# Altium project Peleng.PrjPcb
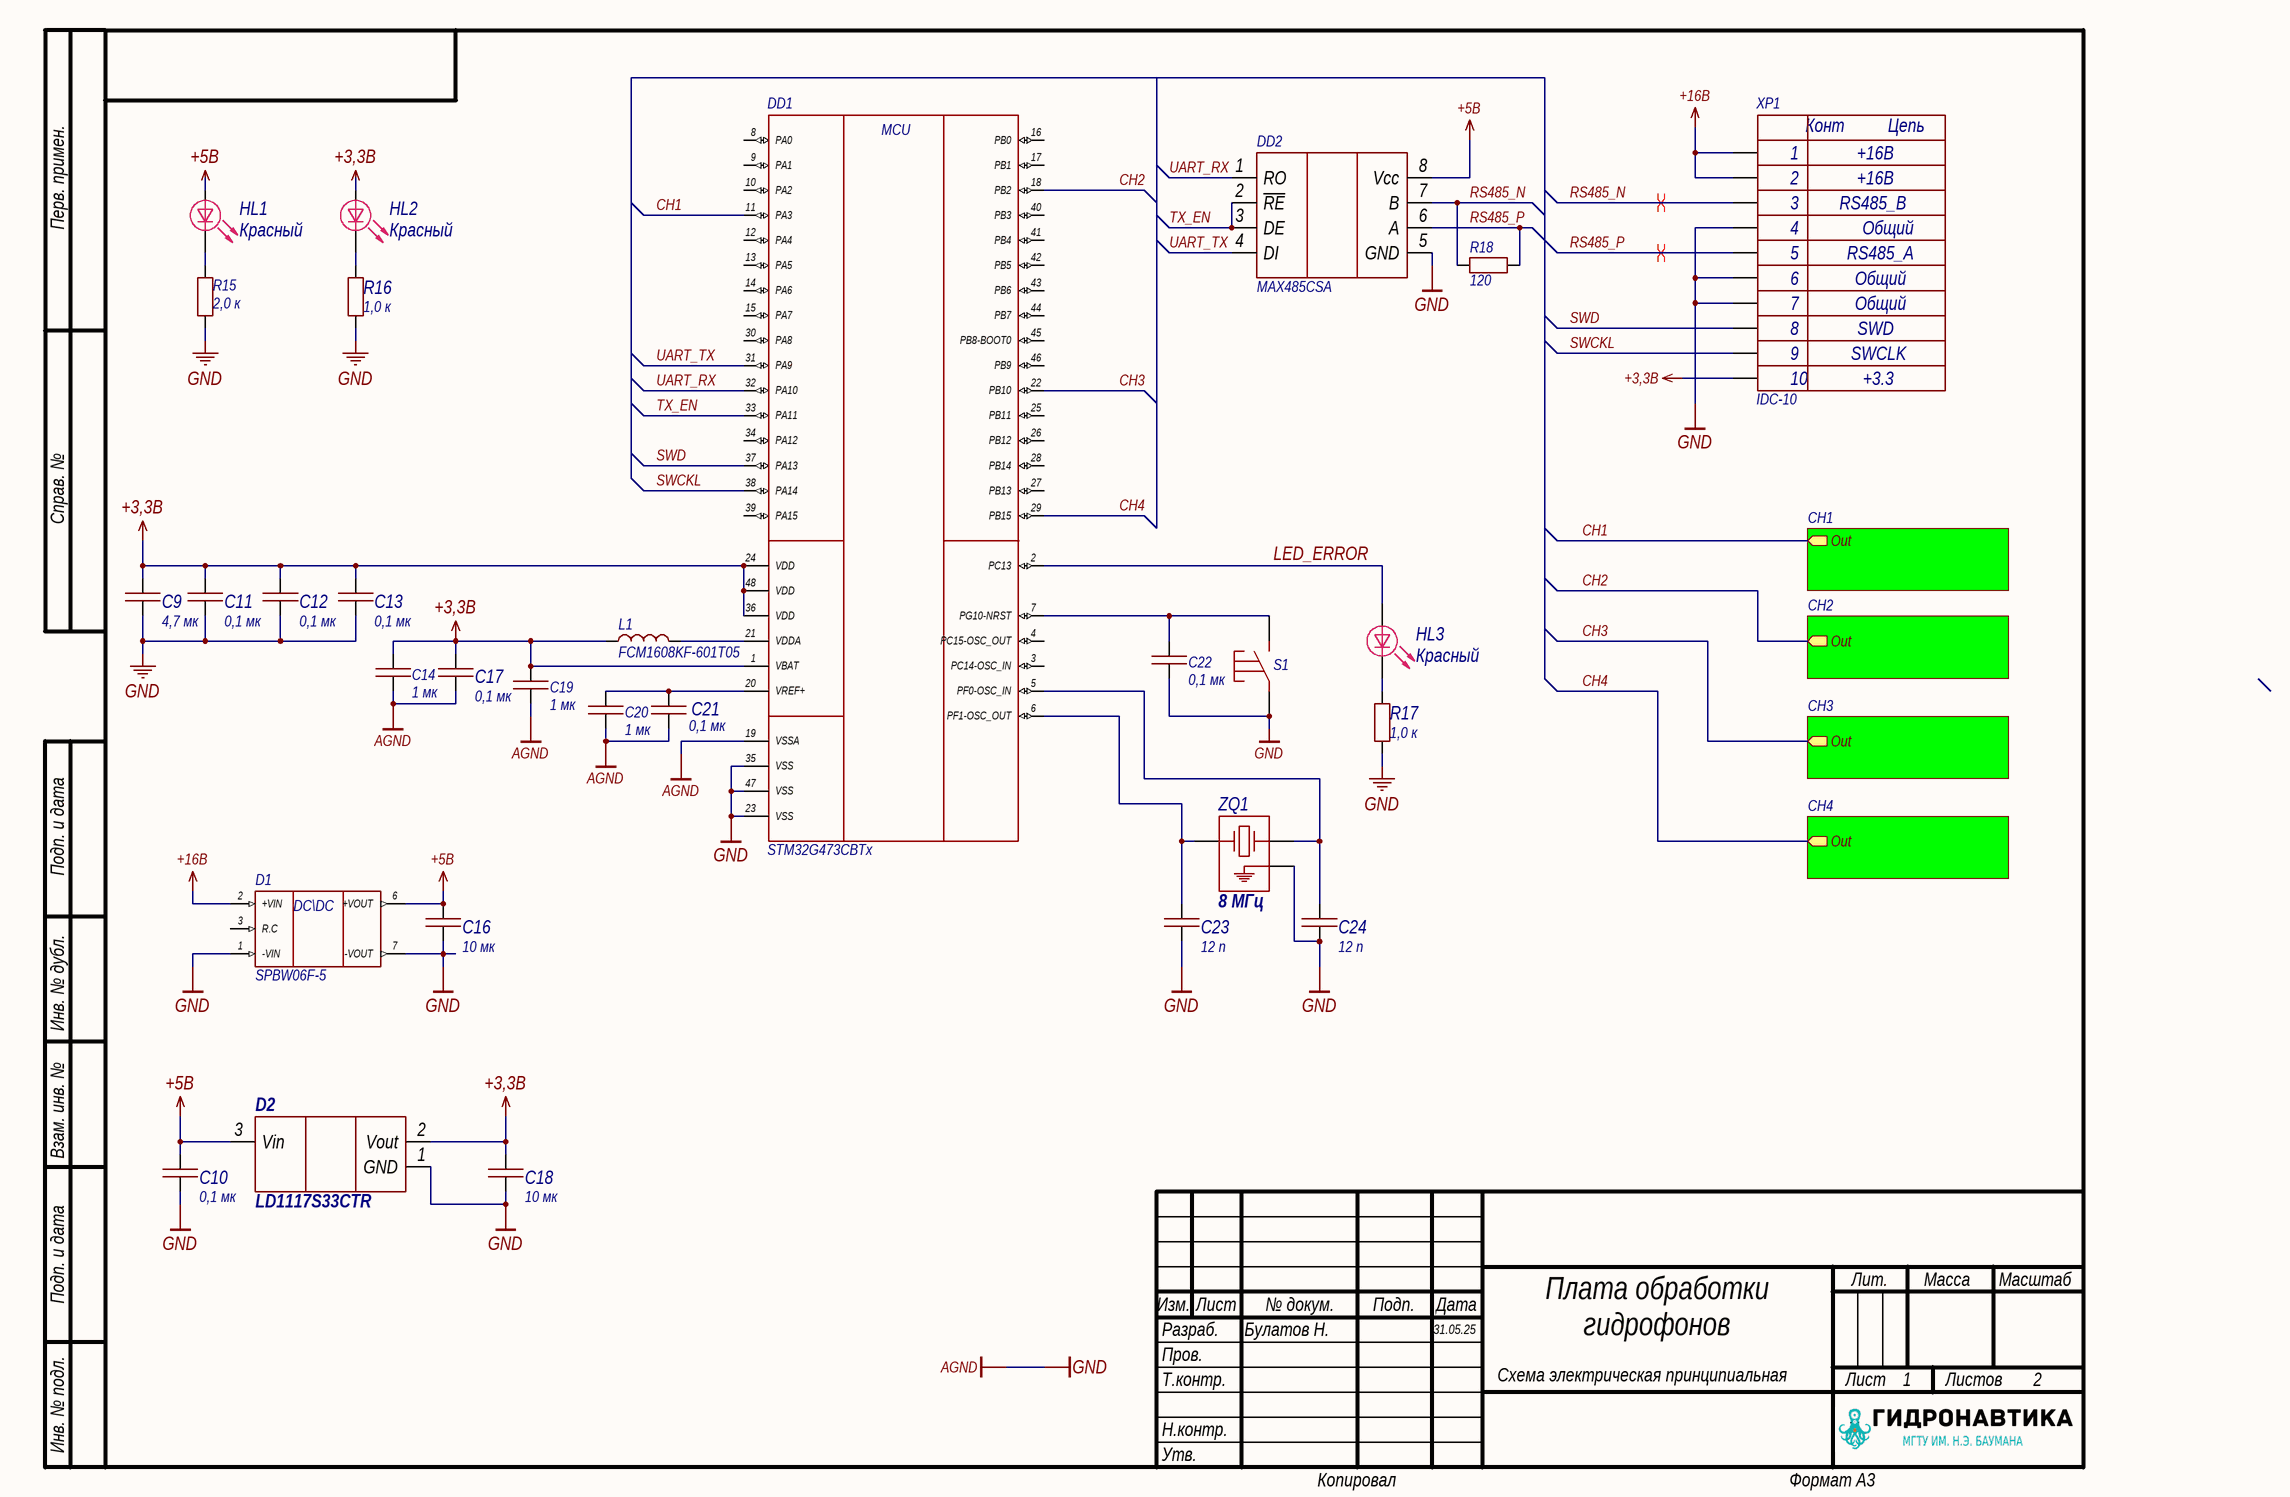
[diagram p0: Main.SchDoc]
Version: 01; Title2: 15В в 300В; Title1: Преобразователь из; Title: Плата обработки гидрофонов; Release_Date: 31.05.25; DrawnBy: Булатов Н.; Decimal_Number_Shematic: ГИДР.123456.001; Decimal_Number_PCB: ГИДР.123456.002
2 sheets, 190 parts. Net scope: hierarchical (ports join the sheet entries above them; power ports are global).
Board file: PCB1.PcbDoc
Sheets:
  Main.SchDoc
    CH1 = Chanel.SchDoc
    CH2 = Chanel.SchDoc
    CH3 = Chanel.SchDoc
    CH4 = Chanel.SchDoc

## Sheet Main.SchDoc: Плата обработки гидрофонов
size 420 x 297 mm; Address1: Address1; Address2: Address2; Address3: Address3; Address4: Address4; SheetNumber: 1; SheetTotal: 2

### Parts
C9  value 4,7 мк  [1206C]  (hidden comment: Capacitor)
C10  value 0,1 мк  [0603C]  (hidden comment: Capacitor)
C11  value 0,1 мк  [0603C]  (hidden comment: Capacitor)
C12  value 0,1 мк  [0603C]  (hidden comment: Capacitor)
C13  value 0,1 мк  [0603C]  (hidden comment: Capacitor)
C14  value 1 мк  [0603C]  (hidden comment: Capacitor)
C16  value 10 мк  [1210C]  (hidden comment: Capacitor)
C17  value 0,1 мк  [0603C]  (hidden comment: Capacitor)
C18  value 10 мк  [1210C]  (hidden comment: Capacitor)
C19  value 1 мк  [0603C]  (hidden comment: Capacitor)
C20  value 1 мк  [0603C]  (hidden comment: Capacitor)
C21  value 0,1 мк  [0603C]  (hidden comment: Capacitor)
C22  value 0,1 мк  [0603C]  (hidden comment: Capacitor)
C23  value 12 п  [0603C]  (hidden comment: Capacitor)
C24  value 12 п  [0603C]  (hidden comment: Capacitor)
D1  SPBW06F-5  [CONV_SPBW06F-12]
D2  LD1117S33CTR  [SOT223]
DD1  STM32G473CBTx  [LQFP48-7x7mm]
DD2  MAX485CSA  [SOIC-8]
HL1  Color: Красный  [0805D]  (hidden comment: LED)
HL2  Color: Красный  [0805D]  (hidden comment: LED)
HL3  Color: Красный  [0805D]  (hidden comment: LED)
L1  FCM1608KF-601T05  [0603L]
R15  value 2,0 к  [0603R]  (hidden comment: Resistor)
R16  value 1,0 к  [0603R]  (hidden comment: Resistor)
R17  value 1,0 к  [0603R]  (hidden comment: Resistor)
R18  value 120  [0603R]  (hidden comment: Resistor)
S1  TSS-TD-19XA-XTR  [TSS-TD-19XA-XTR]  (value not drawn)
XP1  IDC-10  Value1: +16В  Value3: Общий  Value5: RS485_A  Value6: RS485_B  Value8: SWD  Value9: SWCLK  Value10: +3.3  [IDC-10]
ZQ1  value 8 МГц  [QSMD3.2x2.5]  (hidden comment: XTAL_GND)

### Sub-sheets
CH1 = Chanel.SchDoc: Out (out)
CH2 = Chanel.SchDoc: Out (out)
CH3 = Chanel.SchDoc: Out (out)
CH4 = Chanel.SchDoc: Out (out)

### Nets
+3,3В: C9.2 C11.2 C12.2 C13.2 C14.2 C17.2 C18.2 C19.2 D2.2(Vout) DD1.1(VBAT) DD1.24(VDD) DD1.36(VDD) DD1.48(VDD) HL2.1 L1.1 XP1.10
+5В: C10.2 C16.2 D1.6(+VOUT) D2.3(Vin) DD2.8(Vcc) HL1.1
+16В: D1.2(+VIN) XP1.1 XP1.2
AGND: C9.1 C10.1 C11.1 C12.1 C13.1 C14.1 C16.1 C17.1 C18.1 C19.1 C20.1 C21.1 C22.1 C23.1 C24.1 D1.1(-VIN) D1.7(-VOUT) D2.1(GND) DD1.19(VSSA) DD1.23(VSS) DD1.35(VSS) DD1.47(VSS) DD2.5(GND) R15.1 R16.1 R17.1 S1.1 XP1.4 XP1.6 XP1.7 ZQ1.3  [also labelled GND]
CH1: DD1.11(PA3) ; sheet CH1/Out
CH2: DD1.18(PB2) ; sheet CH2/Out
CH3: DD1.22(PB10) ; sheet CH3/Out
CH4: DD1.29(PB15) ; sheet CH4/Out
LED_ERROR: DD1.2(PC13) HL3.1
RS485_N: DD2.7(B) R18.2 XP1.3
RS485_P: DD2.6(A) R18.1 XP1.5
SWCKL: DD1.38(PA14) XP1.9
SWD: DD1.37(PA13) XP1.8
TX_EN: DD1.33(PA11) DD2.2(~{RE}) DD2.3(DE)
UART_RX: DD1.32(PA10) DD2.1(RO)
UART_TX: DD1.31(PA9) DD2.4(DI)
NetC20_2: C20.2 C21.2 DD1.20(VREF+)
NetC22_2: C22.2 DD1.7(PG10-NRST) S1.2
NetC23_2: C23.2 DD1.6(PF1-OSC_OUT) ZQ1.1
NetC24_2: C24.2 DD1.5(PF0-OSC_IN) ZQ1.2
NetDD1_21: DD1.21(VDDA) L1.2
NetHL1_2: HL1.2 R15.2
NetHL2_2: HL2.2 R16.2
NetHL3_2: HL3.2 R17.2

Not connected (* = marked no-connect by the designer): D1 3(R.C); DD1 3(PC14-OSC_IN) 4(PC15-OSC_OUT) 8(PA0) 9(PA1) 10(PA2) 12(PA4) 13(PA5) 14(PA6) 15(PA7) 16(PB0) 17(PB1) 25(PB11) 26(PB12) 27(PB13) 28(PB14) 30(PA8) 34(PA12) 39(PA15) 40(PB3) 41(PB4) 42(PB5) 43(PB6) 44(PB7) 45(PB8-BOOT0) 46(PB9)

### Layout directives
differential pair: RS485_N, RS485_P

### Notes on the sheet
- Перв. примен.
- Справ. №
- Подп. и дата
- Инв. № дубл.
- Взам. инв. №
- Разраб.
- Изм.
- Лист
- № докум.
- Подп.
- Дата
- Лит.
- Масса
- Масштаб
- Пров.
- Т.контр.
- Схема электрическая принципиальная
- Листов
- Инв. № подл.
- Утв.
- Н.контр.
- Копировал
- Формат А3
- (in symbol IDC-10) Конт; Цепь
- (in symbol SPBW06F-12) DC\DC
- (in symbol STM32G473CBTx) MCU

### Library data of the parts
C9 = Capacitor_4,7u_10_50V_X7R_1206C: Конденсатор; Library Path2: Schematic\Capacitor.SchLib; Tolerance: 0,1; Voltage (V): 50; Dielectric: X7R; Capacity (nF): 4700; Part Number: Capacitor_4,7u_10_50V_X7R_1206C
C10-C13 C17 C21 = Capacitor_0,1u_10_50V_X7R_0603C: Конденсатор; Library Path2: Schematic\Capacitor.SchLib; Tolerance: 0,1; Voltage (V): 50; Dielectric: X7R; Capacity (nF): 100; Part Number: Capacitor_0,1u_10_50V_X7R_0603C
C14 C19 C20 = Capacitor_1u_10_50V_X7R_0603C: Конденсатор 0603C ёмкостью 1 мк 10%, 50 В, X7R; Voltage (V): 50; Capacity (nF): 1000; Part Number: Capacitor_1u_10_50V_X7R_0603C; Tolerance: 10%; Dielectric: X7R
C16 C18 = Capacitor_10u_10_35V_X7R_1210C: Конденсатор; Library Path2: Schematic\Capacitor.SchLib; Tolerance: 0,1; Voltage (V): 35; Dielectric: X7R; Capacity (nF): 10000; Part Number: Capacitor_10u_10_35V_X7R_1210C
C22 = Capacitor_0,1u_10_50V_X7R_0603C: Конденсатор 0603C ёмкостью 0,1 мк 10%, 50 В, X7R; Voltage (V): 50; Capacity (nF): 100; Part Number: Capacitor_0,1u_10_50V_X7R_0603C; Tolerance: 10%; Dielectric: X7R
C23 C24 = 0,1 мк: Конденсатор 12п; Part Number: Capacitor
D1 = SPBW06F-12: Isolated Module DC DC Converter 1 Output 12V - - - 500mA 9V - 36V Input; MF: MEAN WELL; SnapEDA_Link: https://www.snapeda.com/parts/SPBW06F-12/Mean+Well/view-part/?ref=snap; Package: SIP-8 Mean Well; Value: *; MP: SPBW06F-12; Check_prices: https://www.snapeda.com/parts/SPBW06F-12/Mean+Well/view-part/?ref=eda
D2 = LD1117S33CTR: Линейный стабилизатор напряжения; Part Number: LD1117S33CTR
DD1 = STM32G473CBTx: Mainstream Arm Cortex-M4 core with DSP and FPU, 170MHz with 128Kbytes of Flash memory, Math Accelerator, High Analog level integration; Manufacturer_Part_Number: stm32g4_lqfp48_t1; Built_By: EMA_Jessica; Vendor: STMicroelectronics; Copyright: Copyright (C) 2016 Accelerated Designs. All rights reserved; RefDes: RefDes; Type: DEV; Value: Value
DD2 = MAX485CSA: RS-485 приёмопередатчик; Part Number: MAX485CSA
HL1-HL3 = LED: Светодиод; Part Number: LED
L1 = Inductance: Катушка индуктивности; Part Number: Inductance
R15 = Resistor_2.0k_1_0603: Резистор номиналом 2,0 кОм 1%; Power: *; Part Number: Resistor_2.0k_1_0603; Tolerance: 1%
R16 R17 = Resistor_1.0k_1_0603: Резистор номиналом 1,0 кОм и точностью 1%; Power: *; Part Number: Resistor_1.0k_1_0603; Tolerance: 1%
R18 = Resistor_120_1_0603: Резистор номиналом 120 Ом 1%; Power: *; Part Number: Resistor_120_1_0603; Tolerance: 1%
S1 = TSS-TD-19XA-XTR: Тактовая кнопка; Автор: glebmih; Part Number: TSS-TD-19XA-XTR; Datasheet: https://cdn.promelec.ru/upload/items/2023/04/17/TSS-TD-19XA.pdf
XP1 = IDC-10: 10-пиновый разъём с ключём; System: Connector; Value2: +16В; Value4: Общий; Value7: Общий; Part Number: IDC-10
ZQ1 = XTAL_GND: Кварцевый резонатор с входом земли; Part Number: XTAL_GND

## Sheet Chanel.SchDoc: Плата обработки гидрофонов
size 420 x 297 mm; Address1: Address1; Address2: Address2; Address3: Address3; Address4: Address4
Used 4 times, as channels CH1, CH2, CH3, CH4. Parts and nets are listed once, with the designators drawn on the sheet.
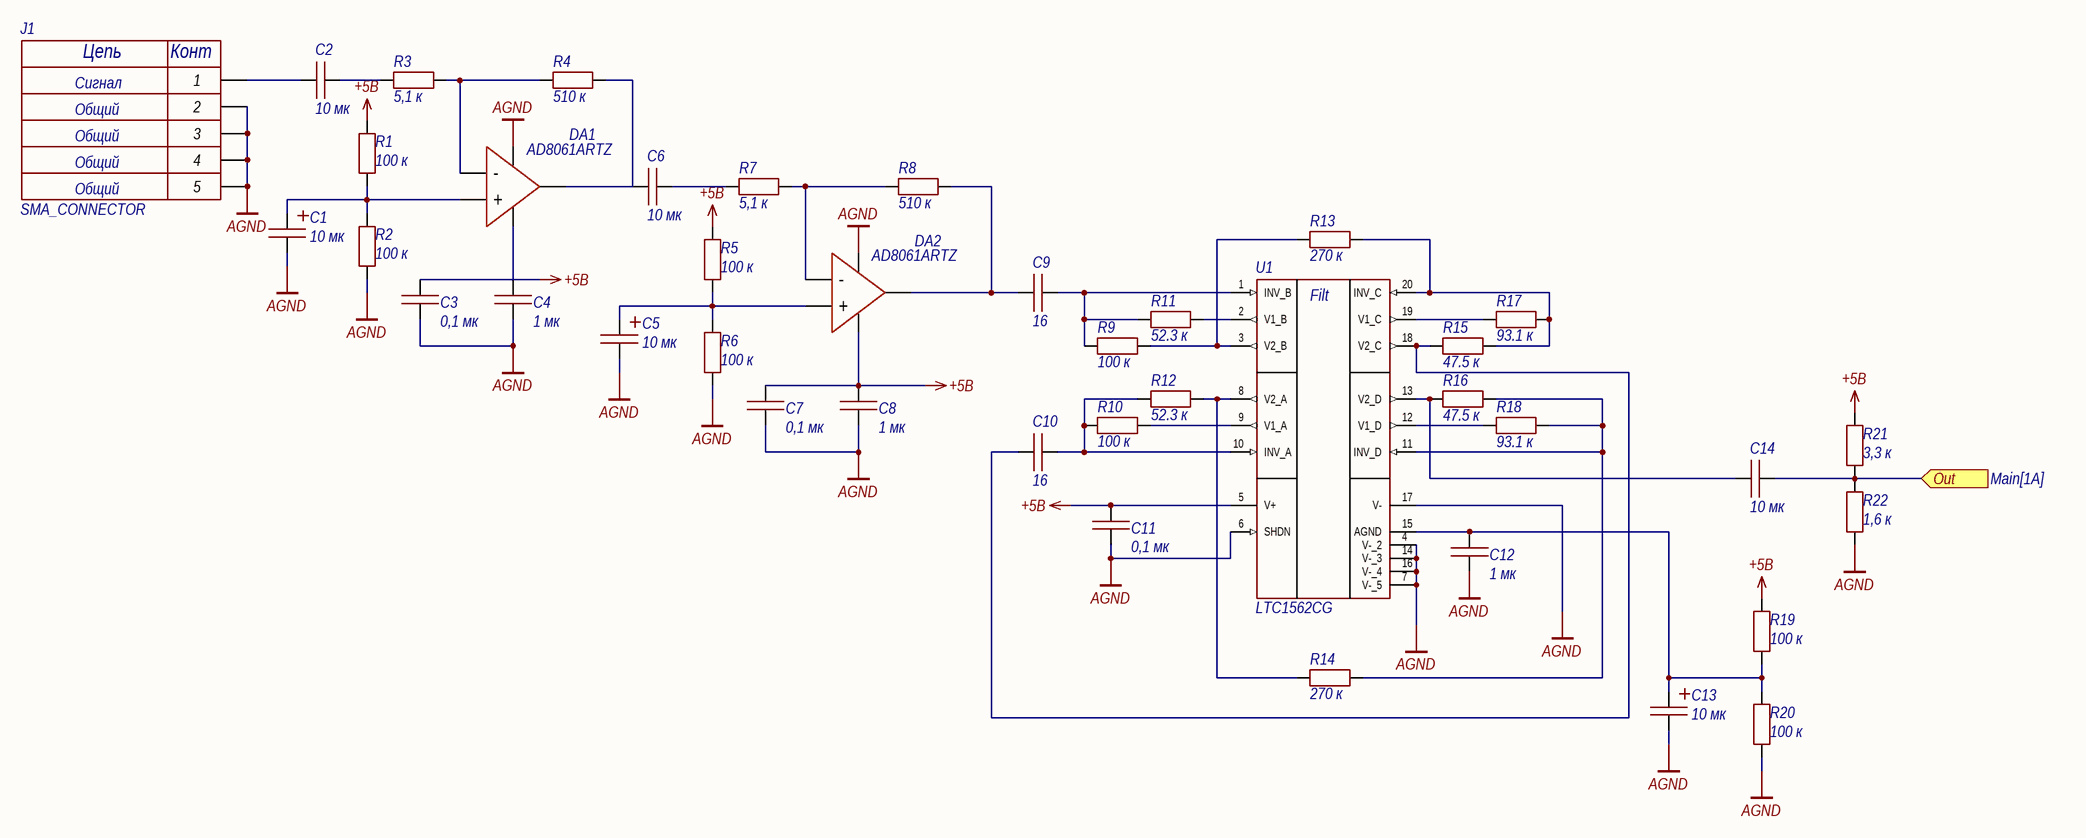
[diagram p1: Chanel.SchDoc]

### Parts
C1  value 10 мк  [TC_A]  (hidden comment: Capacitor)
C2  value 10 мк  [1210C]  (hidden comment: Capacitor)
C3  value 0,1 мк  [0603C]  (hidden comment: Capacitor)
C4  value 1 мк  [0603C]  (hidden comment: Capacitor)
C5  value 10 мк  [TC_A]  (hidden comment: Capacitor)
C6  value 10 мк  [1210C]  (hidden comment: Capacitor)
C7  value 0,1 мк  [0603C]  (hidden comment: Capacitor)
C8  value 1 мк  [0603C]  (hidden comment: Capacitor)
C9  value 16  [0603C]  (hidden comment: Capacitor)
C10  value 16  [0603C]  (hidden comment: Capacitor)
C11  value 0,1 мк  [0603C]  (hidden comment: Capacitor)
C12  value 1 мк  [0603C]  (hidden comment: Capacitor)
C13  value 10 мк  [TC_A]  (hidden comment: Capacitor)
C14  value 10 мк  [0603C]  (hidden comment: Capacitor)
DA1  AD8061ARTZ  [SOT23-5]
DA2  AD8061ARTZ  [SOT23-5]
J1  SMA_CONNECTOR  [SMA_CONNECTOR]
R1  value 100 к  [0603R]  (hidden comment: Resistor)
R2  value 100 к  [0603R]  (hidden comment: Resistor)
R3  value 5,1 к  [0603R]  (hidden comment: Resistor)
R4  value 510 к  [0603R]  (hidden comment: Resistor)
R5  value 100 к  [0603R]  (hidden comment: Resistor)
R6  value 100 к  [0603R]  (hidden comment: Resistor)
R7  value 5,1 к  [0603R]  (hidden comment: Resistor)
R8  value 510 к  [0603R]  (hidden comment: Resistor)
R9  value 100 к  [0603R]  (hidden comment: Resistor)
R10  value 100 к  [0603R]  (hidden comment: Resistor)
R11  value 52.3 к  [0603R]  (hidden comment: Resistor)
R12  value 52.3 к  [0603R]  (hidden comment: Resistor)
R13  value 270 к  [0603R]  (hidden comment: Resistor)
R14  value 270 к  [0603R]  (hidden comment: Resistor)
R15  value 47.5 к  [0603R]  (hidden comment: Resistor)
R16  value 47.5 к  [0603R]  (hidden comment: Resistor)
R17  value 93.1 к  [0603R]  (hidden comment: Resistor)
R18  value 93.1 к  [0603R]  (hidden comment: Resistor)
R19  value 100 к  [0603R]  (hidden comment: Resistor)
R20  value 100 к  [0603R]  (hidden comment: Resistor)
R21  value 3,3 к  [0603R]  (hidden comment: Resistor)
R22  value 1,6 к  [0603R]  (hidden comment: Resistor)
U1  LTC1562CG  [20-SSOP]

### Ports
Out (in, see Main[1A])

### Nets
+5В: C3.2 C4.2 C7.2 C8.2 C11.2 DA1.5(VCC) DA2.5(VCC) R1.2 R5.2 R19.2 R21.2 U1.5(V+)
AGND: C1.2 C3.1 C4.1 C5.2 C7.1 C8.1 C11.1 C12.1 C13.2 DA1.2(GND) DA2.2(GND) J1.G1(2) J1.G2(3) J1.G3(4) J1.G4(5) R2.1 R6.1 R20.1 R22.1 U1.4(V-_2) U1.6(SHDN) U1.7(V-_5) U1.14(V-_3) U1.16(V-_4) U1.17(V-)
Out: C14.2 R21.1 R22.2 ; port Out
NetC1_1: C1.1 DA1.3(+) R1.1 R2.2
NetC2_1: C2.1 J1.1
NetC2_2: C2.2 R3.2
NetC5_1: C5.1 DA2.3(+) R5.1 R6.2
NetC6_1: C6.1 DA1.1 R4.2
NetC6_2: C6.2 R7.2
NetC9_1: C9.1 DA2.1 R8.2
NetC9_2: C9.2 R9.1 R11.1 U1.1(INV_B)
NetC10_1: C10.1 R15.1 U1.18(V2_C)
NetC10_2: C10.2 R10.1 R12.1 U1.10(INV_A)
NetC12_2: C12.2 C13.1 R19.1 R20.2 U1.15(AGND)
NetC14_1: C14.1 R16.1 U1.13(V2_D)
NetDA1_4: DA1.4(-) R3.1 R4.1
NetDA2_4: DA2.4(-) R7.1 R8.1
NetR9_2: R9.2 R13.1 U1.3(V2_B)
NetR10_2: R10.2 U1.9(V1_A)
NetR11_2: R11.2 U1.2(V1_B)
NetR12_2: R12.2 R14.1 U1.8(V2_A)
NetR13_2: R13.2 R15.2 R17.2 U1.20(INV_C)
NetR14_2: R14.2 R16.2 R18.2 U1.11(INV_D)
NetR17_1: R17.1 U1.19(V1_C)
NetR18_1: R18.1 U1.12(V1_D)

### Channels
CH1: designators C1=C1_CH1 C2=C2_CH1#1 C3=C3_CH1#1 C4=C4_CH1#1 C5=C5_CH1#1 C6=C6_CH1 C7=C7_CH1 C8=C8_CH1 C9=C9_CH1 C10=C2_CH1#2 C11=C3_CH1#2 C12=C4_CH1#2 C13=C13_CH1 C14=C5_CH1#2 DA1=DA1_CH1 DA2=DA2_CH1 J1=J1_CH1 R1=R1_CH1#1 R2=R2_CH1#1 R3=R3_CH1#1 R4=R4_CH1#1 R5=R5_CH1#2 R6=R6_CH1#1 R7=R7_CH1#1 R8=R8_CH1#1 R9=R1_CH1#2 R10=R2_CH1#2 R11=R3_CH1#2 R12=R4_CH1#2 R13=R5_CH1#1 R14=R6_CH1#2 R15=R7_CH1#2 R16=R8_CH1#2 R17=R9_CH1 R18=R10_CH1 R19=R19_CH1 R20=R20_CH1 R21=R21_CH1 R22=R22_CH1 U1=U1_CH1; ports Out=CH1
CH2: designators C1=C1_CH2 C2=C2_CH2#1 C3=C3_CH2#1 C4=C4_CH2#1 C5=C5_CH2#1 C6=C6_CH2 C7=C7_CH2 C8=C8_CH2 C9=C9_CH2 C10=C2_CH2#2 C11=C3_CH2#2 C12=C4_CH2#2 C13=C13_CH2 C14=C5_CH2#2 DA1=DA1_CH2 DA2=DA2_CH2 J1=J1_CH2 R1=R1_CH2#1 R2=R2_CH2#1 R3=R3_CH2#1 R4=R4_CH2#1 R5=R5_CH2#2 R6=R6_CH2#1 R7=R7_CH2#1 R8=R8_CH2#1 R9=R1_CH2#2 R10=R2_CH2#2 R11=R3_CH2#2 R12=R4_CH2#2 R13=R5_CH2#1 R14=R6_CH2#2 R15=R7_CH2#2 R16=R8_CH2#2 R17=R9_CH2 R18=R10_CH2 R19=R19_CH2 R20=R20_CH2 R21=R21_CH2 R22=R22_CH2 U1=U1_CH2; ports Out=CH2
CH3: designators C1=C1_CH3 C2=C2_CH3#1 C3=C3_CH3#1 C4=C4_CH3#1 C5=C5_CH3#1 C6=C6_CH3 C7=C7_CH3 C8=C8_CH3 C9=C9_CH3 C10=C2_CH3#2 C11=C3_CH3#2 C12=C4_CH3#2 C13=C13_CH3 C14=C5_CH3#2 DA1=DA1_CH3 DA2=DA2_CH3 J1=J1_CH3 R1=R1_CH3#1 R2=R2_CH3#1 R3=R3_CH3#1 R4=R4_CH3#1 R5=R5_CH3#2 R6=R6_CH3#1 R7=R7_CH3#1 R8=R8_CH3#1 R9=R1_CH3#2 R10=R2_CH3#2 R11=R3_CH3#2 R12=R4_CH3#2 R13=R5_CH3#1 R14=R6_CH3#2 R15=R7_CH3#2 R16=R8_CH3#2 R17=R9_CH3 R18=R10_CH3 R19=R19_CH3 R20=R20_CH3 R21=R21_CH3 R22=R22_CH3 U1=U1_CH3; ports Out=CH3
CH4: designators C1=C1_CH4 C2=C2_CH4#1 C3=C3_CH4#1 C4=C4_CH4#1 C5=C5_CH4#1 C6=C6_CH4 C7=C7_CH4 C8=C8_CH4 C9=C9_CH4 C10=C2_CH4#2 C11=C3_CH4#2 C12=C4_CH4#2 C13=C13_CH4 C14=C5_CH4#2 DA1=DA1_CH4 DA2=DA2_CH4 J1=J1_CH4 R1=R1_CH4#1 R2=R2_CH4#1 R3=R3_CH4#1 R4=R4_CH4#1 R5=R5_CH4#2 R6=R6_CH4#1 R7=R7_CH4#1 R8=R8_CH4#1 R9=R1_CH4#2 R10=R2_CH4#2 R11=R3_CH4#2 R12=R4_CH4#2 R13=R5_CH4#1 R14=R6_CH4#2 R15=R7_CH4#2 R16=R8_CH4#2 R17=R9_CH4 R18=R10_CH4 R19=R19_CH4 R20=R20_CH4 R21=R21_CH4 R22=R22_CH4 U1=U1_CH4; ports Out=CH4

### Notes on the sheet
- Перв. примен.
- Справ. №
- Подп. и дата
- Инв. № дубл.
- Взам. инв. №
- Инв. № подл.
- Изм.
- Лист
- № докум.
- Подп.
- Дата
- Копировал
- Формат А3
- (in symbol LTC1562CG) Filt
- (in symbol SMA_CONNECTOR) Цепь; Конт; Сигнал; Общий

### Library data of the parts
C1 C5 C13 = Capacitor_10u_10_50V_TC_A: Танталовый конденсатор; Tolerance: 0,1; Voltage (V): 50; Type: Tantalum; Capacity (uF): 10; Part Number: Capacitor_10u_10_50V_TC_A
C2 C6 = Capacitor_10u_10_35V_X7R_1210C: Конденсатор 1210C ёмкостью 10 мк 10%, 35 В, X7R; Voltage (V): 35; Capacity (nF): 10000; Part Number: Capacitor_10u_10_35V_X7R_1210C; Tolerance: 10%; Dielectric: X7R
C3 C7 C11 C14 = Capacitor_0,1u_10_50V_X7R_0603C: as C22 on sheet Main; Part Number: Capacitor_0,1u_10_50V_X7R_0603C; Tolerance: 10%; Dielectric: X7R
C4 C8 C12 = Capacitor_1u_10_50V_X7R_0603C: as C14 on sheet Main; Part Number: Capacitor_1u_10_50V_X7R_0603C; Tolerance: 10%; Dielectric: X7R
C9 C10 = Capacitor_1n_10_50V_X7R_0603C: Конденсатор 0603C ёмкостью 1 н 10%, 50 В, X7R; Voltage (V): 50; Capacity (nF): 1; Part Number: Capacitor_1n_10_50V_X7R_0603C; Tolerance: 10%; Dielectric: X7R
DA1 DA2 = TS951ILT: Операционный усилитель Rail-to-Rail, 1-канальный; Автор: glebmih; Part Number: TS951ILT
J1 = SMA_CONNECTOR: Straight SMA Connector; MP: altium_native_batch; Value: *; Package: None; Availability: Unavailable; Price: None
R1-R3 R5-R7 R19 R20 = Resistor_100k_1_0603: Резистор номиналом 100 кОм 1%; Power: *; Part Number: Resistor_100k_1_0603; Tolerance: 1%
R4 R8 = Resistor_510k_1_0603: Резистор номиналом 510 кОм 1%; Power: *; Part Number: Resistor_510k_1_0603; Tolerance: 1%
R9-R14 = Resistor_51k_1_0603: Резистор номиналом 51 кОм 1%; Power: *; Part Number: Resistor_51k_1_0603; Tolerance: 1%
R15 R16 = Resistor_47k_1_0603: Резистор номиналом 47 кОм 1%; Power: *; Part Number: Resistor_47k_1_0603; Tolerance: 1%
R17 R18 = Resistor_91k_1_0603: Резистор номиналом 91 кОм 1%; Power: *; Part Number: Resistor_91k_1_0603; Tolerance: 1%
R21 = Resistor_3.3k_1_0603: Резистор номиналом 3,3 кОм 1%; Power: *; Part Number: Resistor_3.3k_1_0603; Tolerance: 1%
R22 = Resistor_1.6k_1_0603: Резистор номиналом 1,6 кОм 1%; Power: *; Part Number: Resistor_1.6k_1_0603; Tolerance: 1%
U1 = LTC1562CG: Микросхема счетверённый активный полосовый фильтр; MF: Analog Devices; MP: LTC1562CG#TR; SnapEDA_Link: https://www.snapeda.com/parts/LTC1562CG%23TR/Analog+Devices/view-part/?ref=snap; Package: SSOP-20 Linear Technology; Value: *; Check_prices: https://www.snapeda.com/parts/LTC1562CG%23TR/Analog+Devices/view-part/?ref=eda; Part Number: LTC1562CG

## Nets that join several sheets
+5В: Main (6 pins), CH1 (12 pins), CH2 (12 pins), CH3 (12 pins), CH4 (12 pins)
AGND: Main (31 pins), CH1 (25 pins), CH2 (25 pins), CH3 (25 pins), CH4 (25 pins)
CH1: Main (DD1.11), CH1 (C5_CH1#2.2 R21_CH1.1 R22_CH1.2)
CH2: Main (DD1.18), CH2 (C5_CH2#2.2 R21_CH2.1 R22_CH2.2)
CH3: Main (DD1.22), CH3 (C5_CH3#2.2 R21_CH3.1 R22_CH3.2)
CH4: Main (DD1.29), CH4 (C5_CH4#2.2 R21_CH4.1 R22_CH4.2)

## Assembly variants
01: all parts fitted